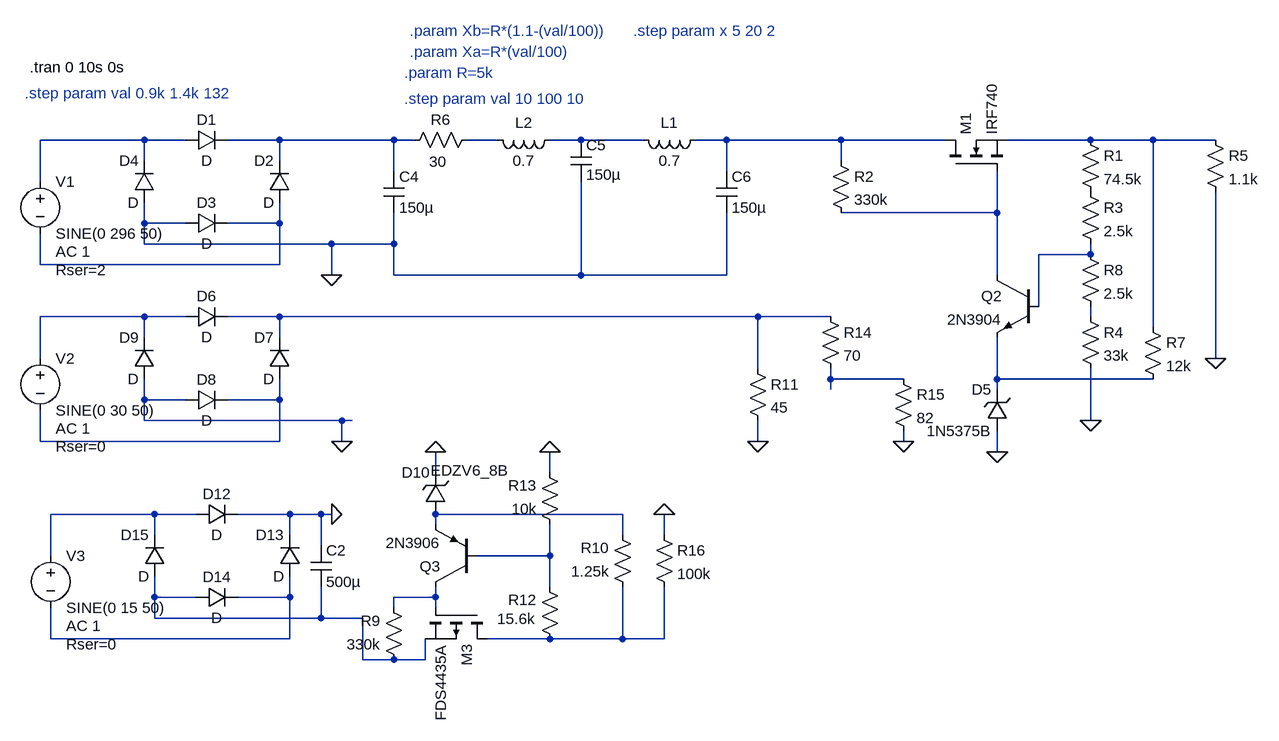
[diagram p0: schematic Napajanje_tranzistor.asc]
Napajanje_tranzistor.asc, the LTspice schematic file:
Version 4
SHEET 1 3192 1016
WIRE -528 32 -688 32
WIRE -464 32 -528 32
WIRE -320 32 -400 32
WIRE -144 32 -320 32
WIRE -112 32 -144 32
WIRE 16 32 -32 32
WIRE 144 32 96 32
WIRE 240 32 144 32
WIRE 368 32 320 32
WIRE 544 32 368 32
WIRE 704 32 544 32
WIRE 928 32 800 32
WIRE 1024 32 928 32
WIRE 1120 32 1024 32
WIRE -528 64 -528 32
WIRE -320 64 -320 32
WIRE 544 64 544 32
WIRE -144 80 -144 32
WIRE 368 80 368 32
WIRE -688 96 -688 32
WIRE 784 144 784 80
WIRE 784 144 544 144
WIRE -528 160 -528 128
WIRE -464 160 -528 160
WIRE -320 160 -320 128
WIRE -320 160 -400 160
WIRE -528 192 -528 160
WIRE -240 192 -528 192
WIRE -144 192 -144 144
WIRE -144 192 -240 192
WIRE 928 208 928 192
WIRE 928 208 848 208
WIRE -688 224 -688 176
WIRE -320 224 -320 160
WIRE -320 224 -688 224
WIRE -240 240 -240 192
WIRE -144 240 -144 192
WIRE 144 240 144 96
WIRE 144 240 -144 240
WIRE 368 240 368 144
WIRE 368 240 144 240
WIRE 784 240 784 144
WIRE 848 288 848 208
WIRE -528 304 -688 304
WIRE -464 304 -528 304
WIRE -320 304 -400 304
WIRE 416 304 -320 304
WIRE 528 304 416 304
WIRE 928 304 928 288
WIRE 1024 320 1024 32
WIRE -528 336 -528 304
WIRE -320 336 -320 304
WIRE -688 368 -688 304
WIRE 1120 368 1120 112
WIRE 416 384 416 304
WIRE 528 400 528 384
WIRE 640 400 528 400
WIRE 784 400 784 336
WIRE 1024 400 784 400
WIRE 528 416 528 400
WIRE 784 416 784 400
WIRE -528 432 -528 400
WIRE -464 432 -528 432
WIRE -320 432 -320 400
WIRE -320 432 -400 432
WIRE -528 464 -528 432
WIRE -224 464 -528 464
WIRE -208 464 -224 464
WIRE 928 464 928 384
WIRE -688 496 -688 448
WIRE -320 496 -320 432
WIRE -320 496 -688 496
WIRE -224 496 -224 464
WIRE 416 496 416 464
WIRE 640 496 640 480
WIRE 784 512 784 480
WIRE -80 544 -80 512
WIRE 96 544 96 512
WIRE -512 608 -672 608
WIRE -448 608 -512 608
WIRE -304 608 -384 608
WIRE -256 608 -304 608
WIRE -240 608 -256 608
WIRE -80 608 -80 592
WIRE 208 608 -80 608
WIRE -80 624 -80 608
WIRE -512 640 -512 608
WIRE -304 640 -304 608
WIRE 208 640 208 608
WIRE 272 640 272 608
WIRE -256 656 -256 608
WIRE -672 672 -672 608
WIRE 96 672 96 624
WIRE 96 672 -16 672
WIRE 96 720 96 672
WIRE -512 736 -512 704
WIRE -448 736 -512 736
WIRE -304 736 -304 704
WIRE -304 736 -384 736
WIRE -80 736 -80 720
WIRE -80 736 -144 736
WIRE -144 752 -144 736
WIRE -80 752 -80 736
WIRE -512 768 -512 736
WIRE -256 768 -256 720
WIRE -256 768 -512 768
WIRE -192 768 -256 768
WIRE -672 800 -672 752
WIRE -304 800 -304 736
WIRE -304 800 -672 800
WIRE 96 800 0 800
WIRE 208 800 208 720
WIRE 208 800 96 800
WIRE 272 800 272 720
WIRE 272 800 208 800
WIRE -192 832 -192 768
WIRE -144 832 -192 832
WIRE -96 832 -96 800
WIRE -96 832 -144 832
FLAG -240 240 0
FLAG 1120 368 0
FLAG 784 512 0
FLAG 928 464 0
FLAG -80 512 0
FLAG 96 512 0
FLAG 416 496 0
FLAG 640 496 0
FLAG -240 608 0
FLAG 272 608 0
FLAG -224 496 0
SYMBOL voltage -688 80 R0
WINDOW 123 24 124 Left 2
WINDOW 39 24 152 Left 2
SYMATTR Value2 AC 1
SYMATTR SpiceLine Rser=2
SYMATTR InstName V1
SYMATTR Value SINE(0 296 50)
SYMBOL diode -464 48 R270
WINDOW 0 32 32 VTop 2
WINDOW 3 0 32 VBottom 2
SYMATTR InstName D1
SYMBOL diode -304 128 R180
WINDOW 0 24 64 Left 2
WINDOW 3 24 0 Left 2
SYMATTR InstName D2
SYMBOL diode -464 176 R270
WINDOW 0 32 32 VTop 2
WINDOW 3 0 32 VBottom 2
SYMATTR InstName D3
SYMBOL diode -512 128 R180
WINDOW 0 24 64 Left 2
WINDOW 3 24 0 Left 2
SYMATTR InstName D4
SYMBOL nmos 704 80 R270
SYMATTR InstName M1
SYMATTR Value IRF740
SYMBOL res 1104 16 R0
SYMATTR InstName R5
SYMATTR Value 1.1k
SYMBOL cap -160 80 R0
SYMATTR InstName C4
SYMATTR Value 150µ
SYMATTR SpiceLine Rser=2
SYMBOL cap 128 32 R0
WINDOW 3 24 53 Left 2
SYMATTR Value 150µ
SYMATTR InstName C5
SYMATTR SpiceLine Rser=2
SYMBOL ind 336 16 R90
WINDOW 0 5 56 VBottom 2
WINDOW 3 32 56 VTop 2
SYMATTR InstName L1
SYMATTR Value 0.7
SYMATTR SpiceLine Rser=7
SYMBOL cap 352 80 R0
SYMATTR InstName C6
SYMATTR Value 150µ
SYMATTR SpiceLine Rser=2
SYMBOL ind 112 16 R90
WINDOW 0 5 56 VBottom 2
WINDOW 3 32 56 VTop 2
SYMATTR InstName L2
SYMATTR Value 0.7
SYMATTR SpiceLine Rser=7
SYMBOL res -16 16 R90
WINDOW 0 0 56 VBottom 2
WINDOW 3 34 60 VTop 2
SYMATTR InstName R6
SYMATTR Value 30
SYMBOL zener 800 480 R180
WINDOW 0 24 64 Left 2
WINDOW 3 24 0 Left 2
SYMATTR InstName D5
SYMATTR Value 1N5375B
SYMATTR Description Diode
SYMATTR Type diode
SYMBOL res 528 48 R0
SYMATTR InstName R2
SYMATTR Value 330k
SYMBOL npn 848 240 M0
SYMATTR InstName Q2
SYMATTR Value 2N3904
SYMBOL res 912 288 R0
SYMATTR InstName R4
SYMATTR Value 33k
SYMBOL res 1008 304 R0
SYMATTR InstName R7
SYMATTR Value 12k
SYMBOL res 912 96 R0
SYMATTR InstName R3
SYMATTR Value 2.5k
SYMBOL res 912 192 R0
SYMATTR InstName R8
SYMATTR Value 2.5k
SYMBOL res 912 16 R0
SYMATTR InstName R1
SYMATTR Value 74.5k
SYMBOL voltage -688 352 R0
WINDOW 123 24 124 Left 2
WINDOW 39 24 152 Left 2
SYMATTR Value2 AC 1
SYMATTR SpiceLine Rser=0
SYMATTR InstName V2
SYMATTR Value SINE(0 30 50)
SYMBOL diode -464 320 R270
WINDOW 0 32 32 VTop 2
WINDOW 3 0 32 VBottom 2
SYMATTR InstName D6
SYMBOL diode -304 400 R180
WINDOW 0 24 64 Left 2
WINDOW 3 24 0 Left 2
SYMATTR InstName D7
SYMBOL diode -464 448 R270
WINDOW 0 32 32 VTop 2
WINDOW 3 0 32 VBottom 2
SYMATTR InstName D8
SYMBOL diode -512 400 R180
WINDOW 0 24 64 Left 2
WINDOW 3 24 0 Left 2
SYMATTR InstName D9
SYMBOL zener -64 608 R180
WINDOW 0 24 64 Left 2
WINDOW 3 -97 67 Left 2
SYMATTR InstName D10
SYMATTR Value EDZV6_8B
SYMATTR Description Diode
SYMATTR Type diode
SYMBOL res -128 848 R180
WINDOW 0 36 76 Left 2
WINDOW 3 36 40 Left 2
SYMATTR InstName R9
SYMATTR Value 330k
SYMBOL res 224 736 R180
WINDOW 0 36 76 Left 2
WINDOW 3 36 40 Left 2
SYMATTR InstName R10
SYMATTR Value 1.25k
SYMBOL res 400 368 R0
SYMATTR InstName R11
SYMATTR Value 45
SYMBOL res 112 816 R180
WINDOW 0 36 76 Left 2
WINDOW 3 38 47 Left 2
SYMATTR InstName R12
SYMATTR Value 15.6k
SYMBOL res 112 640 R180
WINDOW 0 36 76 Left 2
WINDOW 3 36 40 Left 2
SYMATTR InstName R13
SYMATTR Value 10k
SYMBOL res 512 288 R0
SYMATTR InstName R14
SYMATTR Value 70
SYMBOL res 624 384 R0
SYMATTR InstName R15
SYMATTR Value 82
SYMBOL pmos 0 752 R90
SYMATTR InstName M3
SYMATTR Value FDS4435A
SYMBOL pnp -16 720 R180
SYMATTR InstName Q3
SYMATTR Value 2N3906
SYMBOL voltage -672 656 R0
WINDOW 123 24 124 Left 2
WINDOW 39 24 152 Left 2
SYMATTR Value2 AC 1
SYMATTR SpiceLine Rser=0
SYMATTR InstName V3
SYMATTR Value SINE(0 15 50)
SYMBOL diode -448 624 R270
WINDOW 0 32 32 VTop 2
WINDOW 3 0 32 VBottom 2
SYMATTR InstName D12
SYMBOL diode -288 704 R180
WINDOW 0 24 64 Left 2
WINDOW 3 24 0 Left 2
SYMATTR InstName D13
SYMBOL diode -448 752 R270
WINDOW 0 32 32 VTop 2
WINDOW 3 0 32 VBottom 2
SYMATTR InstName D14
SYMBOL diode -496 704 R180
WINDOW 0 24 64 Left 2
WINDOW 3 24 0 Left 2
SYMATTR InstName D15
SYMBOL cap -272 656 R0
SYMATTR InstName C2
SYMATTR Value 500µ
SYMBOL res 256 624 R0
SYMATTR InstName R16
SYMATTR Value 100k
TEXT -704 -80 Left 2 !.tran 0 10s 0s
TEXT -712 -40 Left 2 ;.step param val 0.9k 1.4k 132
TEXT -120 -136 Left 2 ;.param Xb=R*(1.1-(val/100))
TEXT -120 -104 Left 2 ;.param Xa=R*(val/100)
TEXT -128 -72 Left 2 ;.param R=5k
TEXT -128 -32 Left 2 ;.step param val 10 100 10
TEXT 224 -136 Left 2 ;.step param x 5 20 2

The netlist it stands for:
* Napajanje_tranzistor.asc
V1 N001 N008 SINE(0 296 50) AC 1 Rser=2
D1 N001 N002 D
D2 N008 N002 D
D3 0 N008 D
D4 0 N001 D
M1 N005 N007 N006 N006 IRF740
R5 N006 0 1.1k
C4 N002 0 150µ Rser=2
C5 N004 0 150µ Rser=2
L1 N005 N004 0.7 Rser=7
C6 N005 0 150µ Rser=2
L2 N004 N003 0.7 Rser=7
R6 N003 N002 30
D5 0 N014 1N5375B
R2 N005 N007 330k
Q2 N007 N009 N014 0 2N3904
R4 N012 0 33k
R7 N006 N014 12k
R3 P001 N009 2.5k
R8 N009 N012 2.5k
R1 N006 P001 74.5k
V2 N010 N015 SINE(0 30 50) AC 1 Rser=0
D6 N010 N011 D
D7 N015 N011 D
D8 0 N015 D
D9 0 N010 D
D10 N017 0 EDZV6_8B
R9 N019 N021 330k
R10 N022 N017 1.25k
R11 N011 0 45
R12 N022 N018 15.6k
R13 N018 0 10k
R14 N011 N013 70
R15 N013 0 82
M3 N022 N021 N019 N019 FDS4435A
Q3 N021 N018 N017 0 2N3906
V3 N016 N020 SINE(0 15 50) AC 1 Rser=0
D12 N016 0 D
D13 N020 0 D
D14 N019 N020 D
D15 N019 N016 D
C2 0 N019 500µ
R16 0 N022 100k
.model D D
.lib standard.dio
.model NPN NPN
.model PNP PNP
.lib standard.bjt
.model NMOS NMOS
.model PMOS PMOS
.lib standard.mos
.tran 0 10s 0s
* .step param val 0.9k 1.4k 132
* .param Xb=R*(1.1-(val/100))
* .param Xa=R*(val/100)
* .param R=5k
* .step param val 10 100 10
* .step param x 5 20 2
.backanno
.end